# EAGLE design Beta (EAGLE 9.6.2)
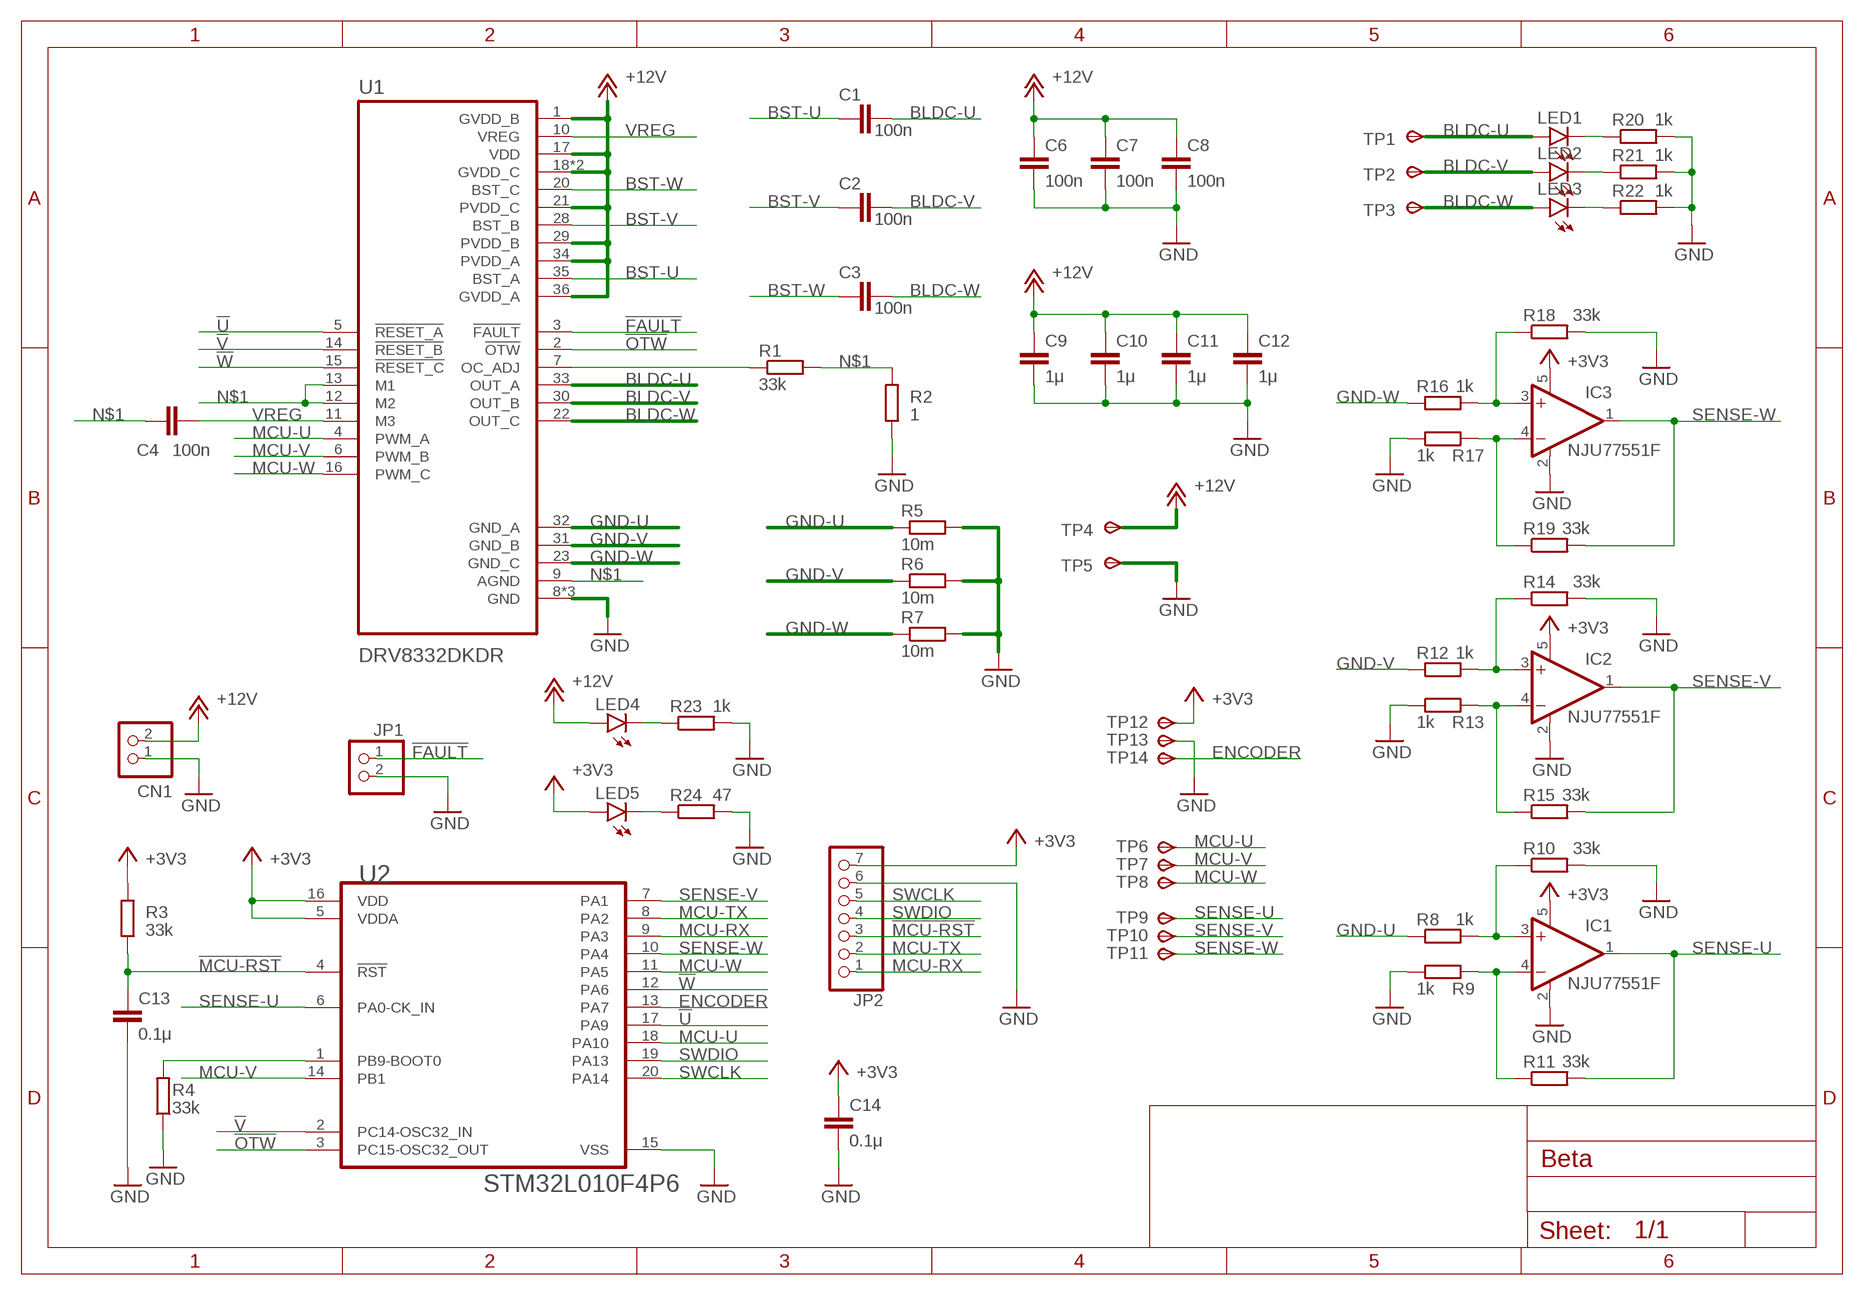
[diagram p0: schematic, sheet 1]

## Parts
C1  100n  C-EUC0603  [C0603]
C2  100n  C-EUC0603  [C0603]
C3  100n  C-EUC0603  [C0603]
C4  100n  C-EUC0603  [C0603]
C6  100n  C-EUC0603  [C0603]
C7  100n  C-EUC0603  [C0603]
C8  100n  C-EUC0603  [C0603]
C9  1μ  C-EUC0603  [C0603]
C10  1μ  C-EUC0603  [C0603]
C11  1μ  C-EUC0603  [C0603]
C12  1μ  C-EUC0603  [C0603]
C13  0.1μ  C-EUC0603  [C0603]
C14  0.1μ  C-EUC0603  [C0603]
CN1  B2B-PH-K-S  [B2B-PH-K-S]
IC1  NJU77551F  OPA340N  [SOT23-5]
IC2  NJU77551F  OPA340N  [SOT23-5]
IC3  NJU77551F  OPA340N  [SOT23-5]
JP1  PINHD-1X2/90  [1X02/90]
JP2  PINHD-1X7/90  [1X07/90]
LED1  LEDCHIPLED_0603  [CHIPLED_0603]
LED2  LEDCHIPLED_0603  [CHIPLED_0603]
LED3  LEDCHIPLED_0603  [CHIPLED_0603]
LED4  LEDCHIPLED_0603  [CHIPLED_0603]
LED5  LEDCHIPLED_0603  [CHIPLED_0603]
R1  33k  R-EU_R0603  [R0603]
R2  1  R-EU_R0603  [R0603]
R3  33k  R-EU_R0603  [R0603]
R4  33k  R-EU_R0603  [R0603]
R5  10m  R-EU_R3216  [R3216]
R6  10m  R-EU_R3216  [R3216]
R7  10m  R-EU_R3216  [R3216]
R8  1k  R-EU_R0603  [R0603]
R9  1k  R-EU_R0603  [R0603]
R10  33k  R-EU_R0603  [R0603]
R11  33k  R-EU_R0603  [R0603]
R12  1k  R-EU_R0603  [R0603]
R13  1k  R-EU_R0603  [R0603]
R14  33k  R-EU_R0603  [R0603]
R15  33k  R-EU_R0603  [R0603]
R16  1k  R-EU_R0603  [R0603]
R17  1k  R-EU_R0603  [R0603]
R18  33k  R-EU_R0603  [R0603]
R19  33k  R-EU_R0603  [R0603]
R20  1k  R-EU_R0603  [R0603]
R21  1k  R-EU_R0603  [R0603]
R22  1k  R-EU_R0603  [R0603]
R23  1k  R-EU_R0603  [R0603]
R24  47  R-EU_R0603  [R0603]
TP1  TPSPAD1-20  [P1-20]
TP2  TPSPAD1-20  [P1-20]
TP3  TPSPAD1-20  [P1-20]
TP4  TPSPAD1-20  [P1-20]
TP5  TPSPAD1-20  [P1-20]
TP6  TPSTP11SQ  [TP11SQ]
TP7  TPSTP11R  [TP11R]
TP8  TPSTP11R  [TP11R]
TP9  TPSTP11SQ  [TP11SQ]
TP10  TPSTP11R  [TP11R]
TP11  TPSTP11R  [TP11R]
TP12  TPSTP11SQ  [TP11SQ]
TP13  TPSTP11R  [TP11R]
TP14  TPSTP11R  [TP11R]
U1  DRV8332DKDR  [SOP65P1420X360-36N]
U2  STMICROELECTRONICS_STM32L010F4P6STMICROELECTRONICS_STM32L010F4P6_0_2  [STMICROELECTRONICS_STM32L010F4P6_2]

## Nets
!FAULT: JP1.1 U1.3(!FAULT)
!MCU-RST: C13.1 JP2.3 R3.1 U2.4(!RST!)
!OTW: U1.2(!OTW) U2.3(PC15-OSC32_OUT)
!U: U1.5(!RESET_A) U2.17(PA9)
!V: U1.14(!RESET_B) U2.2(PC14-OSC32_IN)
!W: U1.15(!RESET_C) U2.12(PA6)
+3V3: C14.1 IC1.5(V+) IC2.5(V+) IC3.5(V+) JP2.7 LED5.A R3.2 TP12.TP(PP) U2.5(VDDA) U2.16(VDD)
+12V: C6.1 C7.1 C8.1 C9.1 C10.1 C11.1 C12.1 CN1.2 LED4.A TP4.TP(PP) U1.1(GVDD_B) U1.17(VDD) U1.18(GVDD_C) U1.19(GVDD_C) U1.21(PVDD_C) U1.29(PVDD_B) U1.34(PVDD_A) U1.36(GVDD_A)
BLDC-U: C1.1 LED1.A TP1.TP(PP) U1.33(OUT_A)
BLDC-V: C2.1 LED2.A TP2.TP(PP) U1.30(OUT_B)
BLDC-W: C3.1 LED3.A TP3.TP(PP) U1.22(OUT_C)
BST-U: C1.2 U1.35(BST_A)
BST-V: C2.2 U1.28(BST_B)
BST-W: C3.2 U1.20(BST_C)
ENCODER: TP14.TP(PP) U2.13(PA7)
GND: C6.2 C7.2 C8.2 C9.2 C10.2 C11.2 C12.2 C13.2 C14.2 CN1.1 IC1.2(V-) IC2.2(V-) IC3.2(V-) JP1.2 JP2.6 R2.1 R4.1 R5.2 R6.2 R7.2 R9.1 R10.2 R13.1 R14.2 R17.1 R18.2 R20.2 R21.2 R22.2 R23.2 R24.2 TP5.TP(PP) TP13.TP(PP) U1.8(GND) U1.24(GND) U1.25(GND) U2.15(VSS)
GND-U: R5.1 R8.1 U1.32(GND_A)
GND-V: R6.1 R12.1 U1.31(GND_B)
GND-W: R7.1 R16.1 U1.23(GND_C)
MCU-RX: JP2.1 U2.9(PA3)
MCU-TX: JP2.2 U2.8(PA2)
MCU-U: TP6.TP(PP) U1.4(PWM_A) U2.18(PA10)
MCU-V: TP7.TP(PP) U1.6(PWM_B) U2.14(PB1)
MCU-W: TP8.TP(PP) U1.16(PWM_C) U2.11(PA5)
N$1: C4.1 R1.2 R2.2 U1.9(AGND) U1.12(M2) U1.13(M1)
N$2: R4.2 U2.1(PB9-BOOT0)
N$3: R1.1 U1.7(OC_ADJ)
N$4: IC1.3(+IN) R8.2 R10.1
N$5: IC2.3(+IN) R12.2 R14.1
N$6: IC1.4(-IN) R9.2 R11.1
N$7: IC2.4(-IN) R13.2 R15.1
N$8: IC3.3(+IN) R16.2 R18.1
N$9: IC3.4(-IN) R17.2 R19.1
N$10: LED1.C R20.1
N$11: LED2.C R21.1
N$12: LED3.C R22.1
N$13: LED4.C R23.1
N$14: LED5.C R24.1
SENSE-U: IC1.1(OUT) R11.2 TP9.TP(PP) U2.6(PA0-CK_IN)
SENSE-V: IC2.1(OUT) R15.2 TP10.TP(PP) U2.7(PA1)
SENSE-W: IC3.1(OUT) R19.2 TP11.TP(PP) U2.10(PA4)
SWCLK: JP2.5 U2.20(PA14)
SWDIO: JP2.4 U2.19(PA13)
VREG: C4.2 U1.10(VREG) U1.11(M3)

## Library data of the parts
C1-C4 C6-C14 = rcl:C-EU: CAPACITOR, European symbol; SPICEPREFIX: C
CN1 = jst-ph:B2B-PH-*: Wire-to-Board 2.0mm pitch top mount connector Source: http://www.jst-mfg.com/product/pdf/jpn/PH.pdf http://www.jst-mfg.com/product/detail.php?series=199
IC1-IC3 = burr-brown:OPA340: Rail-to-Rail Operational Amplifiers Single-Supply, MicroAmplifier(TM) Series; MPN: OPA340NA/3KG4; OC_FARNELL: 1234805; OC_NEWARK: 13M5177
JP1 = pinhead:PINHD-1X2: PIN HEADER
JP2 = pinhead:PINHD-1X7: PIN HEADER
LED1-LED5 = led:LED: LED OSRAM: - CHIPLED LG R971, LG N971, LY N971, LG Q971, LY Q971, LO R971, LY R971 LH N974, LH R974 LS Q976, LO Q976, LY Q976 LO Q996 - Hyper CHIPLED LW Q18S LB Q993, LB Q99A, LB R99A - SideLED LS A670, LO A670, LY A670, LG A670, LP A670 LB A673, LV A673, LT A673, LW A673 LH A674 LY A675 LS A676, LA A676, LO A676, LY A676, LW A676 LS A679, LY A679, LG A679 - Hyper Micro SIDELED® LS Y876, LA Y876, LO Y876, LY Y876 LT Y87S - SmartLED LW L88C, LW L88S LB L89C, LB L89S, LG L890 LS L89K, LO L89K, LY L89K LS L896, LA L896, LO L896, LY L896 - TOPLED LS T670, LO T670, LY T670, LG T670, LP T670 LSG T670, LSP T670, LSY T670, LOP T670, LYG T670 LG T671, LOG T671, LSG T671 LB T673, LV T673, LT T673, LW T673 LH T674 LS T676, LA T676, LO T676, LY T676, LB T676, LH T676, LSB T676, LW T676 LB T67C, LV T67C, LT T67C, LS T67K, LO T67K, LY T67K, LW E67C LS E67B, LA E67B, LO E67B, LY E67B, LB E67C, LV E67C, LT E67C LW T67C LS T679, LY T679, LG T679 LS T770, LO T770, LY T770, LG T770, LP T770 LB T773, LV T773, LT T773, LW T773 LH T774 LS E675, LA E675, LY E675, LS T675 LS T776, LA T776, LO T776, LY T776, LB T776 LHGB T686 LT T68C, LB T68C - Hyper Mini TOPLED® LB M676 - Mini TOPLED Santana® LG M470 LS M47K, LO M47K, LY M47K Source: http://www.osram.convergy.de LUXEON: - LUMILED® LXK2-PW12-R00, LXK2-PW12-S00, LXK2-PW14-U00, LXK2-PW14-V00 LXK2-PM12-R00, LXK2-PM12-S00, LXK2-PM14-U00 LXK2-PE12-Q00, LXK2-PE12-R00, LXK2-PE12-S00, LXK2-PE14-T00, LXK2-PE14-U00 LXK2-PB12-K00, LXK2-PB12-L00, LXK2-PB12-M00, LXK2-PB14-N00, LXK2-PB14-P00, LXK2-PB14-Q00 LXK2-PR12-L00, LXK2-PR12-M00, LXK2-PR14-Q00, LXK2-PR14-R00 LXK2-PD12-Q00, LXK2-PD12-R00, LXK2-PD12-S00 LXK2-PH12-R00, LXK2-PH12-S00 LXK2-PL12-P00, LXK2-PL12-Q00, LXK2-PL12-R00 Source: www.luxeon.com KINGBRIGHT: KA-3528ASYC Source: www.kingbright.com
R1-R24 = rcl:R-EU_: RESISTOR, European symbol; SPICEPREFIX: R
TP1-TP14 = testpad:TPS: TEST PIN
U1 = DRV8332DKDR:DRV8332DKDR; DESCRIPTION: 70-V max high-current 3-phase motor driver with heatsink connection 36-HSSOP -40 to 85; DIGI-KEY_PART_NUMBER: 296-29572-1-ND; MF: Texas Instruments; MP: DRV8332DKDR; PACKAGE: HSSOP-36 Texas Instruments; PURCHASE-URL: https://pricing.snapeda.com/search/part/DRV8332DKDR/?ref=eda
U2 = STMicroelectronics - STM32L010F4P6:STMICROELECTRONICS_STM32L010F4P6: ARM® Cortex®-M0+ STM32L0 Microcontroller IC 32-Bit 32MHz 16KB (16K x 8) FLASH 20-TSSOP; AMBIENT_TEMPERATURE_RANGE_HIGH: +85°C; AMBIENT_TEMPERATURE_RANGE_LOW: -40°C; AUTOMOTIVE: No; CENTROID_NOT_SPECIFIED: No; CORE_ARCHITECTURE: Arm Cortex-M0+; DATASHEET: https://www.st.com/resource/en/datasheet/stm32l010f4.pdf; DATA_BUS_WIDTH: 32bits; DEVICE_CLASS_L1: Integrated Circuits (ICs); DEVICE_CLASS_L2: Embedded Processors and Controllers; DEVICE_CLASS_L3: Microcontrollers; DIGIKEY_DESCRIPTION: IC 16/32-BITS MICROS; DIGIKEY_PART_NUMBER: 497-19364-ND; FOOTPRINT_PARAMETERS_1: {"fp_type":"TSSOP2","params":{"N":{"nom":20,"long name":"Number of leads","min":null,"max":null,"short name":"N","type":"count"},"A":{"nom":false,"long name":"Height","min":false,"max":1200000,"short name":"A","type":"measurement"},"A1":{"nom":false,"long name":"Package clearance","min":50000,"max":150000,"short name":"A1","type":"measurement"},"A2":{"nom":1000000,"long name":"Package height","min":800000,"max":1050000,"short name":"A2","type":"measurement"},"D":{"nom":6500000,"long name":"Package length","min":6400000,"max":6600000,"short name":"D","type":"measurement"},"E":{"nom":6400000,"long name":"Width /w leads","min":6200000,"max":6600000,"short name":"E","type":"measurement"},"E1":{"nom":4400000,"long name":"Package width","min":4300000,"max":4500000,"short name":"E1","type":"measurement"},"B":{"nom":false,"long name":"Lead width","min":190000,"max":300000,"short name":"B","type":"measurement"},"C":{"nom":false,"long name":"Lead thickness","min":90000,"max":200000,"short name":"C","type":"measurement"},"L":{"nom":600000,"long name":"Lead foot length","min":450000,"max":750000,"short name":"L","type":"measurement"},"e":{"nom":650000,"long name":"Lead pitch","min":null,"max":null,"short name":"e","type":"measurement"},"PHI":{"nom":false,"long name":"Lead angle","min":0,"max":8000000,"short name":"PHI","type":"measurement"},"HT":{"default":"No","long name":"Thermal pad","type":"multichoiceparent","short name":"HT","children":[]},"offset x":{"nom":0,"long name":"X Center offset","min":null,"max":null,"short name":"offset x","type":"measurement"},"offset y":{"nom":0,"long name":"Y Center offset","min":null,"max":null,"short name":"offset y","type":"measurement"},"LS":{"default":"Rounded rectangle","long name":"Land shape","type":"multichoice","short name":"LS"},"LS1":{"default":"Rectangle","long name":"Land shape (Pin 1)","type":"multichoice","short name":"LS1"},"solder toe":{"nom":550000,"long name":"Solder fillet (toe)","min":null,"max":null,"short name":"solder toe","type":"fixedmeasurement"},"solder heel":{"nom":450000,"long name":"Solder fillet (heel)","min":null,"max":null,"short name":"solder heel","type":"fixedmeasurement"},"solder side":{"nom":50000,"long name":"Solder fillet (side)","min":null,"max":null,"short name":"solder side","type":"fixedmeasurement"},"courtyard":{"nom":500000,"long name":"Courtyard","min":null,"max":null,"short name":"courtyard","type":"fixedmeasurement"},"SF":{"default":"A (> 0.625mm pitch)","long name":"Packing level","type":"multichoiceparent","short name":"SF","help":"http://support.upverter.com/customer/portal/articles/978783-what-is-a-footprint-packing-level","children":["solder toe","solder heel","solder side","courtyard"]}}}; FOOTPRINT_PARAMETERS_2: {"fp_type":"TSSOP2","params":{"N":{"nom":20,"long name":"Number of leads","min":null,"max":null,"short name":"N","type":"count"},"A":{"nom":false,"long name":"Height","min":false,"max":1200000,"short name":"A","type":"measurement"},"A1":{"nom":false,"long name":"Package clearance","min":50000,"max":150000,"short name":"A1","type":"measurement"},"A2":{"nom":1000000,"long name":"Package height","min":800000,"max":1050000,"short name":"A2","type":"measurement"},"D":{"nom":6500000,"long name":"Package length","min":6400000,"max":6600000,"short name":"D","type":"measurement"},"E":{"nom":6400000,"long name":"Width /w leads","min":6200000,"max":6600000,"short name":"E","type":"measurement"},"E1":{"nom":4400000,"long name":"Package width","min":4300000,"max":4500000,"short name":"E1","type":"measurement"},"B":{"nom":false,"long name":"Lead width","min":190000,"max":300000,"short name":"B","type":"measurement"},"C":{"nom":false,"long name":"Lead thickness","min":90000,"max":200000,"short name":"C","type":"measurement"},"L":{"nom":600000,"long name":"Lead foot length","min":450000,"max":750000,"short name":"L","type":"measurement"},"e":{"nom":650000,"long name":"Lead pitch","min":null,"max":null,"short name":"e","type":"measurement"},"PHI":{"nom":false,"long name":"Lead angle","min":0,"max":8000000,"short name":"PHI","type":"measurement"},"HT":{"default":"No","long name":"Thermal pad","type":"multichoiceparent","short name":"HT","children":[]},"offset x":{"nom":0,"long name":"X Center offset","min":null,"max":null,"short name":"offset x","type":"measurement"},"offset y":{"nom":0,"long name":"Y Center offset","min":null,"max":null,"short name":"offset y","type":"measurement"},"LS":{"default":"Rounded rectangle","long name":"Land shape","type":"multichoice","short name":"LS"},"LS1":{"default":"Rectangle","long name":"Land shape (Pin 1)","type":"multichoice","short name":"LS1"},"solder toe":{"nom":350000,"long name":"Solder fillet (toe)","min":null,"max":null,"short name":"solder toe","type":"fixedmeasurement"},"solder heel":{"nom":350000,"long name":"Solder fillet (heel)","min":null,"max":null,"short name":"solder heel","type":"fixedmeasurement"},"solder side":{"nom":30000,"long name":"Solder fillet (side)","min":null,"max":null,"short name":"solder side","type":"fixedmeasurement"},"courtyard":{"nom":250000,"long name":"Courtyard","min":null,"max":null,"short name":"courtyard","type":"fixedmeasurement"},"SF":{"default":"B (> 0.625mm pitch)","long name":"Packing level","type":"multichoiceparent","short name":"SF","help":"http://support.upverter.com/customer/portal/articles/978783-what-is-a-footprint-packing-level","children":["solder toe","solder heel","solder side","courtyard"]}}}; FOOTPRINT_PARAMETERS_3: {"fp_type":"TSSOP2","params":{"N":{"nom":20,"long name":"Number of leads","min":null,"max":null,"short name":"N","type":"count"},"A":{"nom":false,"long name":"Height","min":false,"max":1200000,"short name":"A","type":"measurement"},"A1":{"nom":false,"long name":"Package clearance","min":50000,"max":150000,"short name":"A1","type":"measurement"},"A2":{"nom":1000000,"long name":"Package height","min":800000,"max":1050000,"short name":"A2","type":"measurement"},"D":{"nom":6500000,"long name":"Package length","min":6400000,"max":6600000,"short name":"D","type":"measurement"},"E":{"nom":6400000,"long name":"Width /w leads","min":6200000,"max":6600000,"short name":"E","type":"measurement"},"E1":{"nom":4400000,"long name":"Package width","min":4300000,"max":4500000,"short name":"E1","type":"measurement"},"B":{"nom":false,"long name":"Lead width","min":190000,"max":300000,"short name":"B","type":"measurement"},"C":{"nom":false,"long name":"Lead thickness","min":90000,"max":200000,"short name":"C","type":"measurement"},"L":{"nom":600000,"long name":"Lead foot length","min":450000,"max":750000,"short name":"L","type":"measurement"},"e":{"nom":650000,"long name":"Lead pitch","min":null,"max":null,"short name":"e","type":"measurement"},"PHI":{"nom":false,"long name":"Lead angle","min":0,"max":8000000,"short name":"PHI","type":"measurement"},"HT":{"default":"No","long name":"Thermal pad","type":"multichoiceparent","short name":"HT","children":[]},"offset x":{"nom":0,"long name":"X Center offset","min":null,"max":null,"short name":"offset x","type":"measurement"},"offset y":{"nom":0,"long name":"Y Center offset","min":null,"max":null,"short name":"offset y","type":"measurement"},"LS":{"default":"Rounded rectangle","long name":"Land shape","type":"multichoice","short name":"LS"},"LS1":{"default":"Rectangle","long name":"Land shape (Pin 1)","type":"multichoice","short name":"LS1"},"solder toe":{"nom":150000,"long name":"Solder fillet (toe)","min":null,"max":null,"short name":"solder toe","type":"fixedmeasurement"},"solder heel":{"nom":250000,"long name":"Solder fillet (heel)","min":null,"max":null,"short name":"solder heel","type":"fixedmeasurement"},"solder side":{"nom":10000,"long name":"Solder fillet (side)","min":null,"max":null,"short name":"solder side","type":"fixedmeasurement"},"courtyard":{"nom":100000,"long name":"Courtyard","min":null,"max":null,"short name":"courtyard","type":"fixedmeasurement"},"SF":{"default":"C (> 0.625mm pitch)","long name":"Packing level","type":"multichoiceparent","short name":"SF","help":"http://support.upverter.com/customer/portal/articles/978783-what-is-a-footprint-packing-level","children":["solder toe","solder heel","solder side","courtyard"]}}}; FOOTPRINT_VARIANT_NAME_0: Recommended_Land_Pattern; FOOTPRINT_VARIANT_NAME_1: IPC_A; FOOTPRINT_VARIANT_NAME_2: IPC_B; FOOTPRINT_VARIANT_NAME_3: IPC_C; FREQUENCY: 32MHz; HEIGHT: 1.2mm; INTERFACE: I2C,SPI,UART,USART,SMBus,Other; IPC_LAND_PATTERN_NAME: SOP65P640X120-20; LEAD_FREE: Yes; MAX_JUNCTION_TEMP: +105°C; MAX_SUPPLY_VOLTAGE: 3.6V; MEMORY_SIZE: 16KBytes; MEMORY_TYPE: FLASH; MF: STMicroelectronics; MFG_PACKAGE_IDENT: TSSOP20-YA; MFG_PACKAGE_IDENT_DATE: 0; MFG_PACKAGE_IDENT_REV: 3; MIN_SUPPLY_VOLTAGE: 1.8V; MOUSER_DESCRIPTION: Cortex M0+ 16K TSSOP20 85°C; MOUSER_PART_NUMBER: 511-STM32L010F4P6; MPN: STM32L010F4P6; NUMBER_OF_A/D_CONVERTERS: 1; NUMBER_OF_ADC_CHANNELS: 7; NUMBER_OF_CORES: 1; NUMBER_OF_I/OS: 16; NUMBER_OF_I2C_CHANNELS: 1; NUMBER_OF_SPI_CHANNELS: 1; NUMBER_OF_TIMERS/COUNTERS: 7; NUMBER_OF_UART_CHANNELS: 1; PACKAGE: TSSOP20; PREFIX: U; RAM_SIZE: 2KBytes; ROHS: Yes; STANDOFF_HEIGHT: 0.05mm; TEMPERATURE_RANGE_HIGH: +105°C; TEMPERATURE_RANGE_LOW: -40°C; VERIFICATION_VERSION: 0.0.0.3

## Board
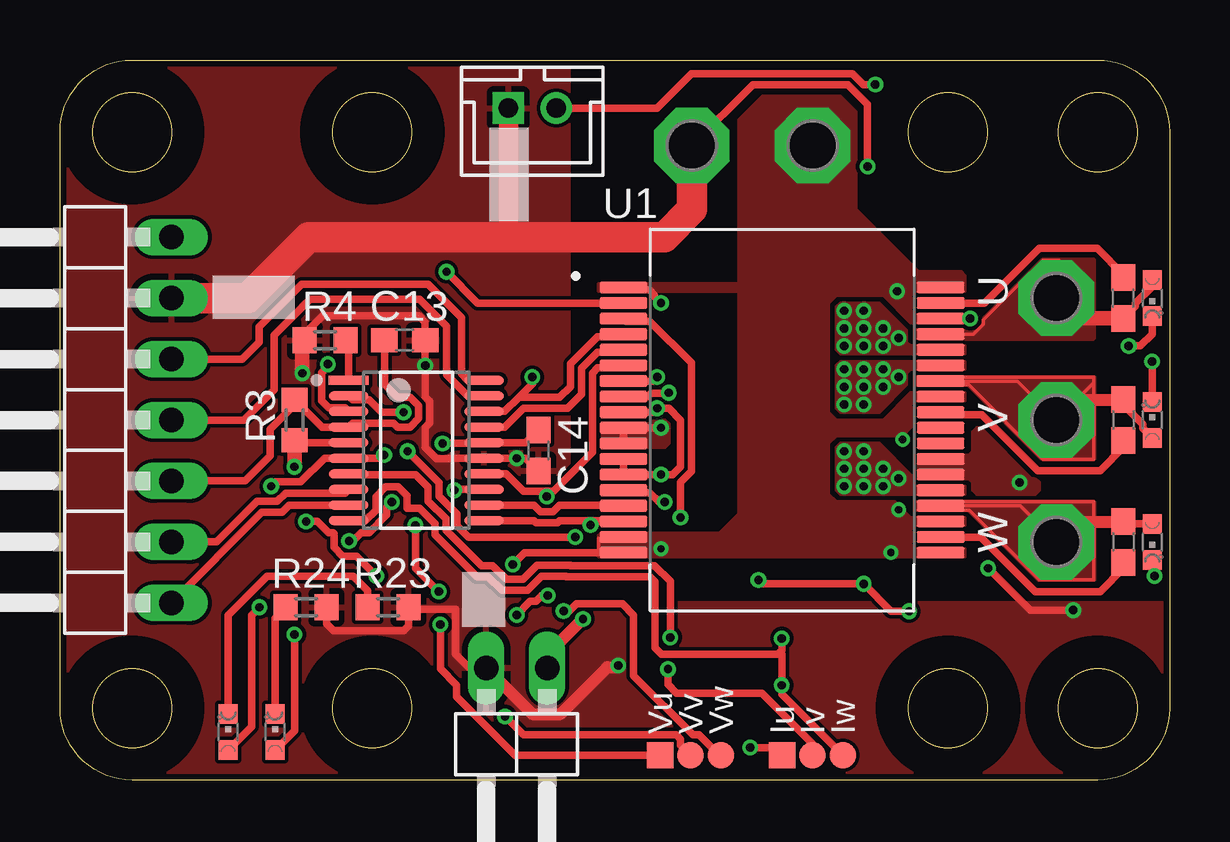
[diagram p1: board, top side]
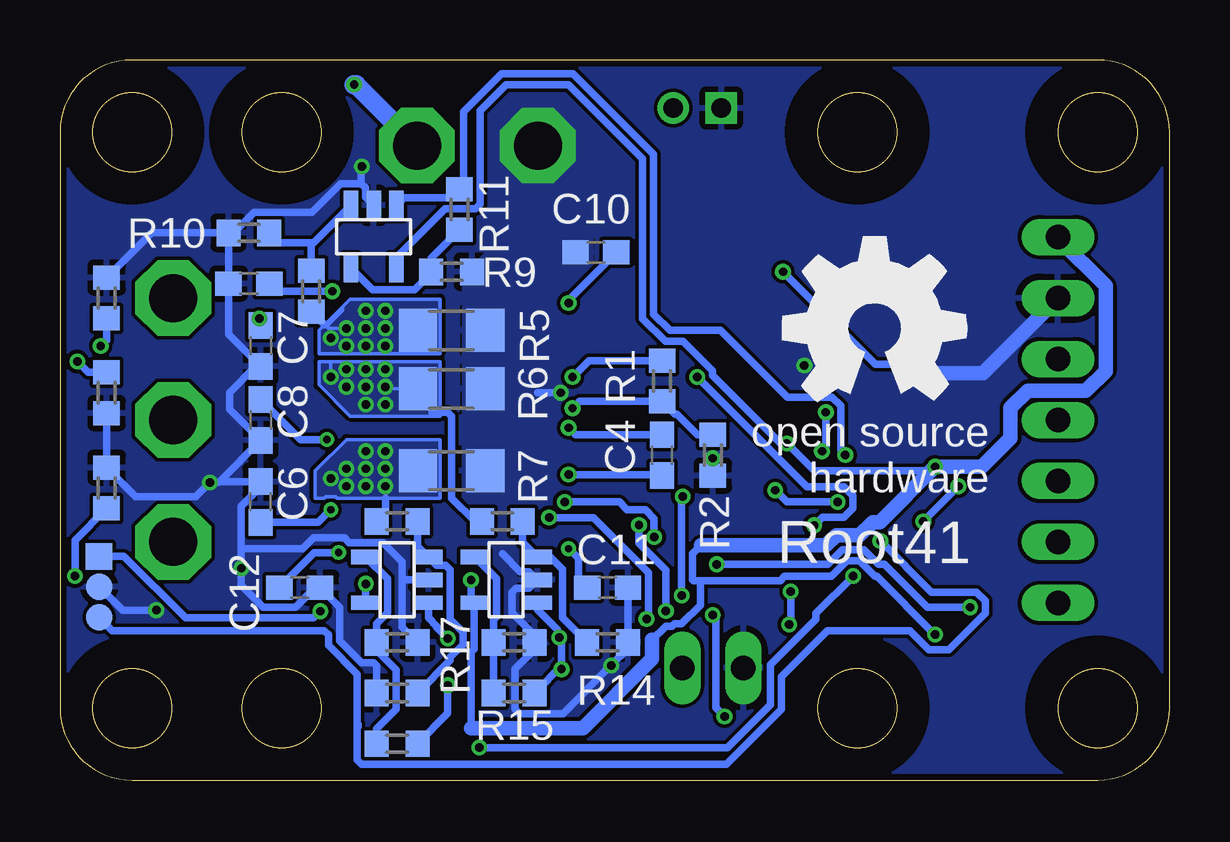
[diagram p2: board, bottom side, seen from below]

Size 46.25 x 30 mm. Coordinates in mm from the lower left corner, seen from the top.
Outline: 43.25,30 arc-90 46.25,27 46.25,3 arc-90 43.25,0 3,0 arc-90 0,3 0,27 arc-90 3,30 43.25,30
Outline: circle at 3,27 radius 1.65
Outline: circle at 37.02,27 radius 1.65
Outline: circle at 37.02,3 radius 1.65
Outline: circle at 13.02,27 radius 1.65
Outline: circle at 43.25,3 radius 1.65
Outline: circle at 3,3 radius 1.65
Outline: circle at 13.02,3 radius 1.65
Outline: circle at 43.25,27 radius 1.65
Copper layers (1*16): Top 0.035mm / dielectric 1.5mm / Bottom 0.035mm
Design rules "SeeedStudio_2layer_DRU_no_angle_20140221": minimum track width 6mil, minimum drill 12mil, track to track 6mil, track to pad 6mil, pad to pad 6mil, via to via 6mil, smd to smd 0mil, copper to edge 10mil, drill to drill 10mil, minimum pad ring 10mil, minimum via ring 6mil, stop-mask expansion 2mil, vias tented up to drill 100mil, thermal gap 10mil
tRestrict: area 40.2,24 to 46.2,30; area 40.2,0 to 46.2,6; area 0,0 to 6,6; area 0,24 to 6,30; area 34,24 to 40,30; area 10,24 to 16,30; area 10,0 to 16,6; area 34,0 to 40,6
bRestrict: area 40.2,24 to 46.2,30; area 40.2,0 to 46.2,6; area 0,0 to 6,6; area 0,24 to 6,30; area 34,24 to 40,30; area 10,24 to 16,30; area 10,0 to 16,6; area 34,0 to 40,6

### Footprints (pad centres in the part's own frame; a part is rotated, then mirrored left to right if it is on the bottom)
C0603 = smd 1.1 x 1: 1 -0.85,0; 2 0.85,0
B2B-PH-K-S = drill 0.8 square: 1 -1,0 | drill 0.8: 2 1,0
SOT23-5 = smd 0.6 x 1.2: 1 -0.95,-1.306; 2 0,-1.306; 3 0.95,-1.306; 4 0.95,1.306; 5 -0.95,1.306
1X02/90 = drill 1.016 long: 1 -1.27,-3.81; 2 1.27,-3.81
1X07/90 = drill 1.016 long: 1 -7.62,-3.81; 2 -5.08,-3.81; 3 -2.54,-3.81; 4 0,-3.81; 5 2.54,-3.81; 6 5.08,-3.81; 7 7.62,-3.81
CHIPLED_0603 = smd 0.8 x 0.8: A 0,-0.75; C 0,0.75
R0603 = smd 1 x 1.1: 1 -0.85,0; 2 0.85,0
R3216 = smd 1.6 x 1.8: 1 -1.4,0; 2 1.4,0
P1-20 = drill 2.007 pad 3.15 octagon: TP 0,0
TP11SQ = smd 1.1 x 1.1: TP 0,0
TP11R = smd 1.1 x 1.1: TP 0,0
SOP65P1420X360-36N = smd 1.99 x 0.48: 1 -6.61,5.525; 2 -6.61,4.875; 3 -6.61,4.225; 4 -6.61,3.575; 5 -6.61,2.925; 6 -6.61,2.275; 7 -6.61,1.625; 8 -6.61,0.975; 9 -6.61,0.325; 10 -6.61,-0.325; 11 -6.61,-0.975; 12 -6.61,-1.625; 13 -6.61,-2.275; 14 -6.61,-2.925; 15 -6.61,-3.575; 16 -6.61,-4.225; 17 -6.61,-4.875; 18 -6.61,-5.525; 19 6.61,-5.525; 20 6.61,-4.875; 21 6.61,-4.225; 22 6.61,-3.575; 23 6.61,-2.925; 24 6.61,-2.275; 25 6.61,-1.625; 26 6.61,-0.975; 27 6.61,-0.325; 28 6.61,0.325; 29 6.61,0.975; 30 6.61,1.625; 31 6.61,2.275; 32 6.61,2.925; 33 6.61,3.575; 34 6.61,4.225; 35 6.61,4.875; 36 6.61,5.525
STMICROELECTRONICS_STM32L010F4P6_2 = smd 1.655 x 0.381: 1 -2.825,2.925; 2 -2.825,2.275; 3 -2.825,1.625; 4 -2.825,0.975; 5 -2.825,0.325; 6 -2.825,-0.325; 7 -2.825,-0.975; 8 -2.825,-1.625; 9 -2.825,-2.275; 10 -2.825,-2.925; 11 2.825,-2.925; 12 2.825,-2.275; 13 2.825,-1.625; 14 2.825,-0.975; 15 2.825,-0.325; 16 2.825,0.325; 17 2.825,0.975; 18 2.825,1.625; 19 2.825,2.275; 20 2.825,2.925

### Placement (x,y rotation side)
C1  44.32,20.08 90 top
C2  44.32,15 270 top
C3  44.32,9.92 270 top
C4  21.15,13.54 90 bottom
C6  37.89,11.59 90 bottom
C7  37.89,18.09 270 bottom
C8  37.89,15 270 bottom
C9  38.38,20.69 180 bottom
C10  23.91,21.99 180 bottom
C11  23.43,8.01 0 bottom
C12  36.26,8.01 0 bottom
C13  14.37,18.32 0 top
C14  19.94,13.73 270 top
CN1  19.69,28 0 top
IC1  33.17,22.64 180 bottom
IC2  27.65,8.34 90 bottom
IC3  32.2,8.34 90 bottom
JP1  19.04,0.86 180 top
JP2  0.84,15 90 top
LED1  45.53,20.08 180 top
LED2  45.53,15 0 top
LED3  45.53,9.92 180 top
LED4  7.01,2 0 top
LED5  8.96,2 0 top
R1  21.15,16.62 270 bottom
R2  19.04,13.54 90 bottom
R3  9.78,15 270 top
R4  11.05,18.32 0 top
R5  29.93,18.74 0 bottom
R6  29.93,16.3 0 bottom
R7  29.93,12.89 0 bottom
R8  35.77,20.36 90 bottom
R9  29.93,21.18 180 bottom
R10  38.38,22.8 180 bottom
R11  29.6,23.77 90 bottom
R12  27.81,10.78 0 bottom
R13  27.32,5.74 180 bottom
R14  23.43,5.74 0 bottom
R15  27.32,3.62 0 bottom
R16  32.2,10.78 0 bottom
R17  32.2,5.74 180 bottom
R18  32.2,3.62 180 bottom
R19  32.2,1.51 0 bottom
R20  44.3,20.08 90 bottom
R21  44.3,16.14 270 bottom
R22  44.3,12.16 90 bottom
R23  13.68,7.2 0 top
R24  10.26,7.2 0 top
TP1  41.53,20.08 0 top
TP2  41.53,15 0 top
TP3  41.53,9.92 0 top
TP4  31.37,26.43 0 top
TP5  26.33,26.43 0 top
TP6  25.02,1.03 0 top
TP7  26.29,1.03 0 top
TP8  27.56,1.03 0 top
TP9  30.1,1.03 0 top
TP10  31.37,1.03 0 top
TP11  32.64,1.03 0 top
TP12  44.62,9.32 270 bottom
TP13  44.62,8.05 270 bottom
TP14  44.62,6.78 270 bottom
U1  30.1,15 0 top
U2  14.86,13.73 0 top
U$1  [OSHW_8MM]  12.32,18.81 0 bottom

### Tracks (layer width: path | path; a pad name or v marks a point on that pad's centre or on a via)
!FAULT  (via drill 0.35)
  Top 0.305: U1.3 23.59,19.12 24.58,19.12 26.32,17.38 26.32,12.86 25.86,12.4 v25.86,10.94
  Top 0.508: v21.8,6.71 20.31,5.22 JP1.1
  Bottom 0.305: v21.8,6.71 21.72,6.79 21.72,8.64 24.02,10.94 v25.86,10.94
!MCU-RST
  Top 0.305: JP2.3 7.72,12.46 8.76,13.5 8.76,14.61 9.78,15.63 R3.1 10.93,14.71 U2.4 12.19,14.86 13.9,14.86 14.06,14.69 14.59,14.69 14.96,15.06 14.96,15.59 14.59,15.96 14.06,15.96 13.52,16.5 C13.1
!OTW  (via drill 0.35)
  Top 0.305: U2.3 11.88,15.51 11.19,15.51 10.9,15.8 10.9,16.97 11.17,17.24 v11.17,17.32 | v16.11,21.18 17.41,19.88 U1.2
  Bottom 0.305: v11.17,17.32 12.26,17.32 v16.11,21.18
!U
  Top 0.305: U2.17 17.69,14.7 18.53,14.7 19.32,15.49 21.15,15.49 21.73,16.07 21.73,17.15 22.4,17.82 23.39,17.82 U1.5
!V  (via drill 0.35)
  Top 0.305: U2.2 12.19,15.85 12.88,15.85 13.4,15.32 v14.32,15.32 | v21.48,10.12 17.03,10.12 16.55,10.6 16.55,11.07 15.8,11.81 15.8,12.38 v14.49,13.7 | U1.14 23.59,11.97 24.58,11.97 24.96,11.59 v25.21,11.59
  Bottom 0.305: v14.32,15.32 14.32,13.86 v14.49,13.7 | v25.21,11.59 22.94,11.59 22.61,11.26 21.85,11.26 21.48,10.89 21.48,10.13 v21.48,10.12
!W
  Top 0.305: U1.15 23.46,11.46 20.82,11.46 20.55,11.19 20.03,11.19 19.76,11.46 U2.12
+3V3  (via drill 0.35)
  Top 0.305: C14.1 19.41,14.05 U2.16 17.66,14.03 v15.95,14.03 | R3.2 9.88,14.05 U2.5 | v29.11,8.34 29.27,8.18 v33.5,8.18 34.64,7.03 v35.39,7.03 | LED5.A 9.78,2.06 v9.78,6.06
  Top 0.61: v9.78,13.05 R3.2
  Bottom 0.305: v9.78,13.05 9.94,12.89 14.81,12.89 v15.95,14.03 16.22,14.03 19.05,16.86 19.05,17.05 20.29,18.28 21.02,18.28 21.96,19.23 21.96,25.89 25.05,28.98 27.65,28.98 28.75,27.88 28.75,24 28.93,23.81 30.2,23.81 32.23,21.78 IC1.5 | IC3.5 v33.51,8.17 v33.5,8.18 | v29.11,8.34 29.11,7.54 IC2.5 29,7.34 29,5.45 29.11,5.33 29.11,2.16 | v9.78,6.06 12.2,8.48 12.28,8.48 12.93,9.13 13.45,9.13 14.1,8.48 16.05,8.48 16.22,8.31 19.55,8.31 | 21.57,5.84 20.99,6.41 20.73,6.41 20.64,6.5 20.34,6.5 19.55,7.29 19.55,8.31 | 19.52,9.77 19.88,9.42 19.88,8.34 19.85,8.31 19.55,8.31 | TP12.TP 43.59,9.32 41.02,6.75 35.67,6.75 v35.39,7.03
  Bottom 0.61: JP2.7 4.65,22.57 2.67,20.59 2.67,17.04 3.48,16.22 5.91,16.22 6.63,15.51 6.63,14.25 7.82,13.05 v9.78,13.05 12.08,10.75 12.38,10.75 12.92,10.2 13.89,10.2 14.32,9.77 19.52,9.77 | 29.11,2.16 27.68,2.16 24.45,2.16 21.57,5.05 21.57,5.84
+12V  (via drill 0.3, 0.35)
  Top 0.152: U1.17 23.44,10.07 22.45,10.07 22.45,9.47
  Top 0.305: v37.94,19.23 U1.34 | U1.1 23.59,20.42 24.58,20.42 24.79,20.21 24.79,20.13 v25.05,19.88 | v33.99,28.98 33.5,28.98 33.04,29.43 26.32,29.43 24.89,28 CN1.2 | LED4.A 7.99,2.22 7.99,6.88 v8.31,7.2 | v18.88,8.99 19.36,9.47 22.45,9.47 U1.18
  Bottom 0.305: C8.1 36.23,14.19 v35.12,14.19 | v34.96,11.26 35.49,10.74 C6.1 | C12.1 35.65,9.47 v34.64,9.47 | C11.1 24.64,8.38 24.64,9.23 v25.05,9.64 | C9.1 37.2,20.36 v34.9,20.36 | C7.1 37.89,19.17 v37.94,19.23 | C10.1 25.05,20 v25.05,19.88 | v8.31,7.2 10.1,7.2 11.89,8.99 12.13,8.99 12.74,9.59 13.64,9.59 14.24,8.99 v18.88,8.99
  Bottom 0.813: TP4.TP 33.91,28.98 v33.99,28.98
  pour Top (no thermals): 28.3,27.51 29.27,28.49 32.52,28.49 33.17,27.84 33.17,23.77 35.77,21.18 37.56,21.18 37.73,21.01 37.73,20.36 35.61,20.36 35.45,20.2 35.45,19.55 35.61,19.39 37.73,19.39 37.73,19.06 35.45,19.06 34.31,20.2 32.36,20.2 32.04,19.88 32.04,15.32 32.36,15 34.31,15 35.45,16.14 37.73,16.14 37.73,15.81 35.61,15.81 35.45,15.65 35.45,14.68 35.12,14.35 32.36,14.35 32.04,14.03 32.04,11.91 32.36,11.59 34.8,11.59 35.45,10.94 37.73,10.94 37.73,10.61 35.61,10.61 35.45,10.45 35.45,9.8 35.61,9.64 37.73,9.64 37.73,9.31 30.09,9.31 28.3,11.1
  pour Top (no thermals): 27.49,10.29 22.45,10.29 22.45,9.31 30.09,9.31 30.09,11.75 29.52,12.32
  pour Top (no thermals): 22.61,20.69 22.45,20.69 22.45,20.36 28.95,20.36 28.62,20.69
BLDC-U
  Top 0.152: 41.62,21.66 41.14,21.66 40.98,21.66 38.49,19.18 38.49,19 38.08,18.57 U1.33
  Top 0.305: C1.1 44.83,19.73 44.83,19.86 45.53,20.56 LED1.A
  Top 0.61: TP1.TP 42.38,19.23 C1.1
  pour Top (no thermals): 35.72,18.41 43.09,18.41 43.09,21.66 40.98,21.66 38.05,18.74 35.72,18.74
BLDC-V
  Top 0.152: 43.09,16.56 TP2.TP 39.91,16.62 U1.30 | 43.09,16.56 43.09,16.79 35.77,16.79 35.77,16.46 37.89,16.46 40.98,13.38 43.09,13.38 43.09,16.56
  Top 0.305: LED2.A 45.13,14.65 45.13,14.83 44.32,15.63 C2.1
  Top 0.508: TP2.TP 42.38,15.85 C2.1
  pour Top (no thermals): 35.72,16.79 43.09,16.79 43.09,13.38 40.98,13.38 37.89,16.46 35.72,16.46
BLDC-W
  Top 0.152: 35.77,11.59 41.95,11.59 43.09,11.59 43.09,8.34 40.81,8.34 37.91,11.24 35.79,11.24 35.77,11.26 35.94,11.43 U1.22 40.02,11.43 TP3.TP
  Top 0.305: LED3.A 44.42,10.67 C3.1
  Top 0.508: TP3.TP 42.38,10.77 C3.1
  pour Top (no thermals): 35.72,11.59 43.09,11.59 43.09,8.34 40.81,8.34 37.89,11.26 35.72,11.26
BST-U
  Top 0.305: U1.35 38.54,19.88 40.81,22.15 43.23,22.15 44.32,21.06 C1.2
BST-V
  Top 0.305: C2.2 44.32,13.86 43.36,12.89 40.76,12.89 38.43,15.22 36.81,15.22 U1.28
BST-W
  Top 0.305: C3.2 44.32,8.82 43.36,7.85 40.65,7.85 38.38,10.12 U1.20
ENCODER  (via drill 0.35)
  Top 0.305: U2.13 16.47,12.11 v16.44,12.07 | v12.05,9.96 12.21,9.96 12.56,10.31 12.88,10.31 13.62,11.06 13.62,11.37 v13.84,11.59
  Bottom 0.305: TP14.TP 44.06,6.22 35.23,6.22 35.06,6.05 35.06,5.62 33.86,4.41 33.86,2.19 | v16.44,12.07 15.95,11.59 v13.84,11.59 | v12.05,9.96 9.92,7.83 8.05,7.83 7.68,7.46 7.68,6.94 9.19,5.43 10.04,5.43 10.83,6.22 14.26,6.22 16.18,4.31 16.18,2.95 18.47,0.66 33.68,0.66 33.86,0.84 33.86,2.19 | 33.86,2.19 33.83,2.22 33.83,2.32
GND  (via drill 0.35)
  Top 0.305: C14.2 19.41,13.4 v19.04,13.4 U2.15 17.68,13.4 16.22,13.4 16.21,13.39 15.69,13.39 15.22,13.86 15.22,14.68 15.41,14.87 15.41,15.78 15.22,15.97 v15.22,17.27 C13.2 15.22,19.08 14.96,19.34 10.95,19.34 10.2,18.59 R4.1 | U1.8 24.48,15.97 24.63,16.12 25.36,16.12 v25.38,16.14 | TP5.TP 28.88,28.98 32.85,28.98 33.66,28.16 v33.66,25.56 | R24.2 11.11,6.51 11.4,6.22 14.32,6.22 14.53,6.43 R23.2 14.61,7.11 16.49,7.11 16.49,5.23 17.05,4.67 JP1.2 | v42.24,7.08 40.44,7.08 v38.69,8.82
  Top 0.508: JP1.2 19.7,2.74 20.86,2.74 22.82,4.7 23.2,4.7 v23.27,4.77
  Top 0.61: v10.1,16.95 10.1,18.22 R4.1
  Top 0.813: CN1.1 18.69,22.64 18.71,22.62
  Top 1.27: JP2.6 7.82,20.08 10.36,22.62 18.71,22.62 25.19,22.62 26.35,23.77 26.35,26.41 TP5.TP
  Bottom 0.305: 39.6,12.44 C8.2 39.19,15.45 39.19,16.14 38.09,17.24 C7.2 39.23,18.57 C9.2 39.23,22.64 | 39.6,12.44 C6.2 37.89,12.22 38.69,11.41 38.69,9.64 | 39.6,12.44 39.64,12.4 v40,12.4 40.6,11.8 43.09,11.8 R22.2 R21.2 | 38.69,9.64 v38.69,8.82 38.69,8.11 37.79,7.21 36.44,7.21 35.63,8.01 C12.2 34.6,7.2 34.6,5.81 33.68,4.88 33.17,4.88 33.05,4.76 R18.2 | 38.69,9.64 36.13,9.64 35.69,10.09 34.38,10.09 34.19,9.89 32.78,9.89 31.98,9.09 31.98,8.34 | R17.1 31.98,6.37 31.98,8.34 | 39.23,22.64 R10.2 42.44,22.8 R20.2 | C11.2 R14.2 22.57,5.47 v23.27,4.77 25.27,2.77 27.1,2.77 27.28,2.95 27.28,4.63 26.48,5.43 R13.1 26.48,6.03 27.41,6.96 27.41,7.81 27.23,7.99 26.69,7.99 IC2.2 26.69,8.68 27.07,8.68 27.81,9.43 | 33.7,24.85 33.52,24.67 33.52,24.29 IC1.2 | 33.7,24.85 34.55,24.85 35.74,23.66 38.15,23.66 39.17,22.64 39.23,22.64 | R2.1 v19.04,13.4 | v25.38,16.14 26.35,16.14 | IC3.2 31.98,8.34 | v33.66,25.56 33.7,25.53 33.7,24.85 | TP13.TP 43.64,7.08 v42.24,7.08
  Bottom 0.61: JP2.6 7.78,16.95 v10.1,16.95
  pour Top (no thermals): 37.89,12.56 35.77,12.56 35.77,13.54 37.89,13.54 38.05,13.7 38.05,14.51 38.21,14.68 38.38,14.68 40.49,12.56 40.65,12.56 40.81,12.4 40.81,12.07 40.65,11.91 38.21,11.91 38.05,12.07 38.05,12.4
  pour Bottom (no thermals): 25.21,28.49 27.49,28.49 28.14,27.84 28.14,22.31 29.44,21.01 29.44,11.75 27.16,11.75 25.54,13.38 25.54,20.52 25.21,20.85 24.56,20.85 24.07,21.34 24.07,27.35
  pour Bottom: -1.65,31.51 47.88,31.51 47.88,-1.51 -1.65,-1.51
  pour Top: -0.38,31.51 21.21,31.51 21.21,7.38 47.88,7.38 47.88,-1.51 -1.65,-1.51 -1.65,31.51
GND-U  (via drill 0.35)
  Bottom 0.152: v34.31,18.82 35.08,18.82 35.14,18.88 34.48,19.55 34.48,19.71 | 34.48,19.71 34.15,20.04 30.41,20.04 30.41,17.76 35.45,17.76 35.45,18.74 35.23,18.96 34.48,19.71
  Bottom 0.305: 35.23,18.96 R8.1
  other vias: 32.69,19.55 33.5,19.55 32.69,18.09 33.5,18.09 32.69,18.82 33.5,18.82 34.31,18.09 34.96,18.41
  pour Top (no thermals): 37.73,17.76 32.52,17.76 32.36,17.93 32.36,19.71 32.52,19.88 34.15,19.88 35.29,18.74 35.29,18.25 35.45,18.09 37.73,18.09
  pour Bottom (no thermals): 30.41,20.04 34.15,20.04 35.45,18.74 35.45,17.76 30.41,17.76
GND-V  (via drill 0.35)
  Bottom 0.152: 34.96,17.44 v34.96,16.79 | 34.96,17.44 30.41,17.44 30.41,15.16 34.15,15.16 35.45,16.46 35.45,17.44 34.96,17.44 | 30.74,15.32 31.32,15.91 R6.1 32.61,16.3 v32.69,16.38
  Bottom 0.305: R12.1 28.95,10.78 29.93,11.75 29.93,15.16 30.09,15.32 30.74,15.32
  other vias: 32.69,17.11 33.5,17.11 34.31,17.11 32.69,15.65 33.5,15.65 34.31,16.38 33.5,16.38
  pour Top (no thermals): 37.73,17.44 37.73,17.11 35.45,17.11 35.29,16.95 35.29,16.46 34.15,15.32 32.52,15.32 32.36,15.49 32.36,17.27 32.52,17.44
  pour Bottom (no thermals): 30.41,17.44 35.45,17.44 35.45,16.46 34.15,15.16 30.41,15.16
GND-W  (via drill 0.35)
  Bottom 0.152: v32.69,12.24 32.69,11.75 | 32.69,11.75 34.7,11.75 34.74,11.8 35.18,11.8 35.23,11.75 35.61,11.75 35.61,12.89 34.31,14.19 30.41,14.19 30.41,11.75 32.69,11.75
  Bottom 0.305: R16.1 32.69,11.14 32.69,11.75
  other vias: 33.5,12.24 34.31,12.24 32.69,13.7 33.5,13.7 32.69,12.97 33.5,12.97 34.31,12.97 34.96,12.56
  pour Top (no thermals): 37.73,11.91 32.52,11.91 32.36,12.07 32.36,13.86 32.52,14.03 34.15,14.03 35.45,12.72 35.45,12.4 35.61,12.24 37.73,12.24
  pour Bottom (no thermals): 30.41,14.19 34.31,14.19 35.61,12.89 35.61,11.75 30.41,11.75
MCU-RX
  Top 0.305: U2.9 9.56,11.46 9.25,11.15 8.42,11.15 JP2.1
MCU-TX
  Top 0.305: JP2.2 6.54,9.92 8.23,11.61 9.06,11.61 9.41,11.95 11.88,11.95 U2.8
MCU-U  (via drill 0.35)
  Top 0.305: U2.18 18.54,15.36 19.13,15.95 | 19.13,15.95 20.82,15.95 21.28,16.39 21.28,17.34 22.4,18.47 23.39,18.47 U1.4 | v15.86,6.48 15.86,4.63 16.54,3.95 16.54,3.47 18.98,1.03 TP6.TP | v15.79,7.85 14.81,8.82 v14.81,10.61 | v19.69,16.79 19.69,16.5 19.13,15.95
  Bottom 0.305: v15.86,6.48 15.79,6.55 v15.79,7.85 | v19.69,16.79 15.12,12.22 13.58,12.22 13.21,11.85 13.21,11.33 13.58,10.96 14.47,10.96 v14.81,10.61
MCU-V  (via drill 0.35)
  Top 0.305: 20.18,12.03 19.31,12.03 18.58,12.75 U2.14 | 20.18,12.03 20.57,12.03 22.19,13.65 22.19,16.96 22.4,17.17 23.39,17.17 U1.6 | v19.04,6.88 19.6,7.44 19.84,7.44 20.09,7.69 v20.34,7.69 | v20.29,11.82 20.29,11.91 20.18,12.03 | TP7.TP 25.88,1.45 25.88,1.71 25.7,1.88 19.32,1.88 v18.55,2.65
  Bottom 0.305: v19.04,6.88 18.92,6.75 18.92,3.02 v18.55,2.65 | v20.34,7.69 20.34,11.77 v20.29,11.82
MCU-W  (via drill 0.35)
  Top 0.305: U2.11 19.76,10.8 19.84,10.73 20.74,10.73 20.82,10.8 23.46,10.8 U1.16 22.26,10.78 v22.11,10.63 | v20.99,7.04 21.24,7.04 21.54,7.34 23.44,7.34 23.91,6.88 23.91,4.35 26.38,1.88 26.64,1.88 27.5,1.03 TP8.TP 27.23,1.03
  Bottom 0.305: v20.99,7.04 20.99,8.75 22.11,9.86 v22.11,10.62 v22.11,10.63
N$1  (via drill 0.35)
  Top 0.305: U1.9 24.73,15.32 v24.89,15.49 25.38,15.49 25.86,15 25.86,13.05 25.54,12.72 v25.05,12.72 U1.13 U1.12
  Bottom 0.305: R2.2 19.67,14.39 20.52,15.24 20.62,15.24 R1.2 24.6,15.78 v24.89,15.49 | C4.1 21.19,12.72 23.59,12.72 v25.05,12.72
N$2
  Top 0.305: U2.1 12.04,18.19 R4.2
N$3  (via drill 0.35)
  Top 0.305: v24.89,16.79 24.73,16.62 U1.7
  Bottom 0.305: R1.1 24.2,17.48 v24.89,16.79
N$4
  Bottom 0.305: IC1.3 35.68,22.38 | 35.68,22.38 35.77,22.29 R8.2 | 35.68,22.38 37.11,22.38 R10.1
N$5
  Bottom 0.305: R12.2 26.96,9.91 IC2.3 25.8,9.29 25.29,8.78 25.29,6.76 R14.1
N$6
  Bottom 0.305: IC1.4 33.22,20.43 31.47,20.43 30.77,21.12 R9.2 30.77,21.75 R11.1
N$7
  Bottom 0.305: IC2.4 28.05,8.38 28.05,6.8 28.18,6.68 R13.2 R15.1
N$8
  Bottom 0.305: R16.2 31.35,9.74 IC3.3 30.55,8.94 30.17,8.94 29.99,8.76 29.99,6.7 29.45,6.16 29.45,5.64 29.99,5.1 29.99,4.99 R18.1
N$9
  Bottom 0.305: IC3.4 32.6,8.38 32.6,6.96 33.05,6.51 R17.2 33.05,5.4 32.24,4.6 32.24,2.95 33.05,2.14 R19.1
N$10  (via drill 0.35)
  Top 0.305: LED1.C 45.53,18.58 45.04,18.09 v44.55,18.09
  Bottom 0.305: v44.55,18.09 44.3,18.33 R20.1
N$11  (via drill 0.35)
  Top 0.305: v45.52,17.44 45.52,16.13 45.53,16.12 LED2.C
  Bottom 0.305: v45.52,17.44 45.08,16.99 R21.1
N$12  (via drill 0.35)
  Top 0.305: LED3.C 45.53,8.5 v45.62,8.5
  Bottom 0.305: R22.1 45.62,10 v45.62,8.5
N$13
  Top 0.305: LED4.C 7.01,6.88 8.64,8.5 12.21,8.5 12.82,7.89 R23.1
N$14
  Top 0.305: LED5.C 8.96,6.75 R24.1
SENSE-U  (via drill 0.35)
  Top 0.305: v13.51,13.54 13.38,13.4 U2.6 11.02,13.4 10.04,12.42 8.98,12.42 v8.8,12.24 | TP9.TP 29.78,1.35 v28.77,1.35 | v10.26,10.78 10.73,10.78 11.19,10.31 11.38,10.31 11.42,10.27 11.42,9.7 11.79,9.33 12.36,9.33 v13.19,8.5
  Bottom 0.305: IC1.1 31.9,24.27 29.96,24.27 R11.2 29.44,24.79 29.44,27.84 27.84,29.43 24.86,29.43 21.5,26.08 21.5,19.41 20.83,18.74 18.71,18.74 15.93,15.96 14.06,15.96 13.69,15.59 13.69,13.72 v13.51,13.54 | v13.19,8.5 14.74,6.95 14.74,6.71 16.63,4.81 16.63,3.14 18.42,1.35 v28.77,1.35 | v10.26,10.78 v8.8,12.24
SENSE-V  (via drill 0.35)
  Top 0.305: U2.7 12.06,12.72 14.81,12.72 15.35,12.19 15.35,11.62 16.1,10.88 16.1,10.41 17.58,8.93 18.04,8.93 18.61,8.36 19.3,8.36 19.88,8.94 21.27,8.94 21.29,8.93 24.78,8.93 25.44,8.27 v25.44,5.94 | TP10.TP 31.37,1.52 29.26,3.62 25.7,3.62 25.34,3.98 v25.34,4.62
  Bottom 0.305: R15.2 26.41,3.69 25.34,4.76 | 25.34,4.76 25.34,5.85 v25.44,5.94 25.51,6.01 25.51,6.25 26.34,7.09 IC2.1 | v25.34,4.62 25.34,4.76
SENSE-W  (via drill 0.35)
  Top 0.305: 29.93,5.25 25.07,5.25 24.81,5.52 24.81,8.26 24.59,8.47 21.1,8.47 21.09,8.48 20.07,8.48 19.49,7.9 18.42,7.9 17.85,8.47 17.39,8.47 15.64,10.22 15.64,10.68 14.99,11.33 14.47,11.33 14.47,11.85 14.1,12.22 13.58,12.22 13.17,11.81 13.17,11.25 12.72,10.8 U2.10 | 29.93,5.25 30.09,5.25 v30.09,3.95 30.09,3.58 TP11.TP | 29.93,5.25 30.09,5.41 v30.09,5.9
  Bottom 0.305: v30.09,5.9 30.55,6.36 30.55,6.41 30.89,6.76 IC3.1 | R19.2 30.09,2.78 v30.09,3.95
SWCLK
  Top 0.305: JP2.5 7.6,17.54 8.31,18.24 8.31,18.89 10.07,20.66 15.34,20.66 16.73,19.27 16.73,16.92 16.99,16.66 U2.20
SWDIO
  Top 0.305: JP2.4 7.66,15 8.93,16.26 8.93,18.53 10.1,19.7 10.1,19.71 10.43,20.04 14.99,20.04 16.11,18.91 16.11,16.89 17,16 U2.19
VREG  (via drill 0.35)
  Top 0.305: U1.11 U1.10 v25.05,14.68
  Bottom 0.305: C4.2 24.76,14.39 v25.05,14.68
  pour Top (no thermals): 22.61,14.84 22.61,13.86 25.21,13.86 25.38,14.03 25.38,14.84 25.21,15 24.73,15 24.56,14.84

### Text on the board
tPlace: U | V | W
bPlace: Root41
tNames: Vu | Vv | Vw | Iu | Iv | Iw